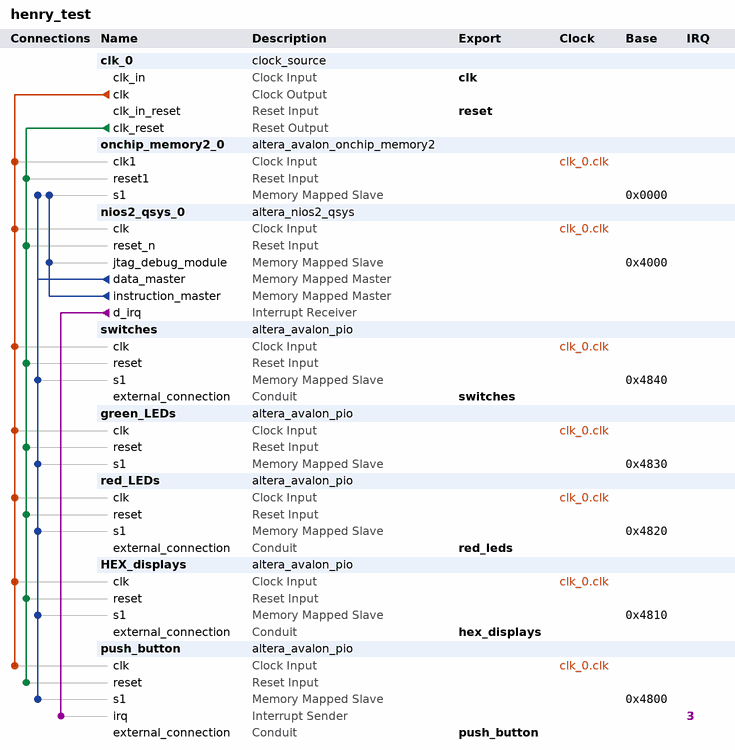
[diagram p0: system contents]
# Platform Designer (Qsys) system henry_test, Cyclone II EP2C35F672C6
# Parameters at their usual value, and those the tool derives, are not listed.
package require -exact qsys 13.0.1.99.2
create_system henry_test
set_project_property DEVICE_FAMILY {Cyclone II}
set_project_property DEVICE EP2C35F672C6

add_instance clk_0 clock_source 13.0
set_instance_parameter_value clk_0 clockFrequency 50000000

add_instance onchip_memory2_0 altera_avalon_onchip_memory2 13.0.1.99.2
set_instance_parameter_value onchip_memory2_0 dataWidth 32
set_instance_parameter_value onchip_memory2_0 dualPort false
set_instance_parameter_value onchip_memory2_0 initMemContent true
set_instance_parameter_value onchip_memory2_0 initializationFileName onchip_mem.hex
set_instance_parameter_value onchip_memory2_0 memorySize 16384

add_instance nios2_qsys_0 altera_nios2_qsys 13.0
set_instance_parameter_value nios2_qsys_0 resetSlave onchip_memory2_0.s1
set_instance_parameter_value nios2_qsys_0 mmu_TLBMissExcSlave None
set_instance_parameter_value nios2_qsys_0 exceptionSlave onchip_memory2_0.s1
set_instance_parameter_value nios2_qsys_0 breakSlave nios2_qsys_0.jtag_debug_module
set_instance_parameter_value nios2_qsys_0 muldiv_multiplierType NoneSmall
set_instance_parameter_value nios2_qsys_0 impl Small
set_instance_parameter_value nios2_qsys_0 icache_size 4096

add_instance switches altera_avalon_pio 13.0.1.99.2
set_instance_parameter_value switches direction Input
set_instance_parameter_value switches width 8

add_instance green_LEDs altera_avalon_pio 13.0.1.99.2
set_instance_parameter_value green_LEDs direction Output
set_instance_parameter_value green_LEDs width 8

add_instance red_LEDs altera_avalon_pio 13.0.1.99.2
set_instance_parameter_value red_LEDs direction Output
set_instance_parameter_value red_LEDs width 16

add_instance HEX_displays altera_avalon_pio 13.0.1.99.2
set_instance_parameter_value HEX_displays direction Output
set_instance_parameter_value HEX_displays width 32

add_instance push_button altera_avalon_pio 13.0.1.99.2
set_instance_parameter_value push_button captureEdge true
set_instance_parameter_value push_button direction Input
set_instance_parameter_value push_button edgeType FALLING
set_instance_parameter_value push_button generateIRQ true
set_instance_parameter_value push_button irqType EDGE
set_instance_parameter_value push_button width 1

# connections
add_connection clk_0.clk green_LEDs.clk clock
add_connection clk_0.clk HEX_displays.clk clock
add_connection clk_0.clk nios2_qsys_0.clk clock
add_connection clk_0.clk onchip_memory2_0.clk1 clock
add_connection clk_0.clk push_button.clk clock
add_connection clk_0.clk red_LEDs.clk clock
add_connection clk_0.clk switches.clk clock
add_connection clk_0.clk_reset green_LEDs.reset reset
add_connection clk_0.clk_reset HEX_displays.reset reset
add_connection clk_0.clk_reset nios2_qsys_0.reset_n reset
add_connection clk_0.clk_reset onchip_memory2_0.reset1 reset
add_connection clk_0.clk_reset push_button.reset reset
add_connection clk_0.clk_reset red_LEDs.reset reset
add_connection clk_0.clk_reset switches.reset reset
add_connection nios2_qsys_0.data_master green_LEDs.s1 avalon
set_connection_parameter_value nios2_qsys_0.data_master/green_LEDs.s1 baseAddress 0x4830
add_connection nios2_qsys_0.data_master HEX_displays.s1 avalon
set_connection_parameter_value nios2_qsys_0.data_master/HEX_displays.s1 baseAddress 0x4810
add_connection nios2_qsys_0.data_master onchip_memory2_0.s1 avalon
set_connection_parameter_value nios2_qsys_0.data_master/onchip_memory2_0.s1 baseAddress 0x0000
add_connection nios2_qsys_0.data_master push_button.s1 avalon
set_connection_parameter_value nios2_qsys_0.data_master/push_button.s1 baseAddress 0x4800
add_connection nios2_qsys_0.data_master red_LEDs.s1 avalon
set_connection_parameter_value nios2_qsys_0.data_master/red_LEDs.s1 baseAddress 0x4820
add_connection nios2_qsys_0.data_master switches.s1 avalon
set_connection_parameter_value nios2_qsys_0.data_master/switches.s1 baseAddress 0x4840
add_connection nios2_qsys_0.instruction_master nios2_qsys_0.jtag_debug_module avalon
set_connection_parameter_value nios2_qsys_0.instruction_master/nios2_qsys_0.jtag_debug_module baseAddress 0x4000
add_connection nios2_qsys_0.instruction_master onchip_memory2_0.s1 avalon
set_connection_parameter_value nios2_qsys_0.instruction_master/onchip_memory2_0.s1 baseAddress 0x0000
add_connection nios2_qsys_0.d_irq push_button.irq interrupt
set_connection_parameter_value nios2_qsys_0.d_irq/push_button.irq irqNumber 3

# exported interfaces
add_interface clk clock sink
set_interface_property clk EXPORT_OF clk_0.clk_in
add_interface reset reset sink
set_interface_property reset EXPORT_OF clk_0.clk_in_reset
add_interface switches conduit end
set_interface_property switches EXPORT_OF switches.external_connection
add_interface red_leds conduit end
set_interface_property red_leds EXPORT_OF red_LEDs.external_connection
add_interface hex_displays conduit end
set_interface_property hex_displays EXPORT_OF HEX_displays.external_connection
add_interface push_button conduit end
set_interface_property push_button EXPORT_OF push_button.external_connection

set_interconnect_requirement {$system} qsys_mm.clockCrossingAdapter HANDSHAKE
set_interconnect_requirement {$system} qsys_mm.maxAdditionalLatency 1

save_system henry_test.qsys
